# Altium schematic sheet Power.SchDoc
size A4; DocumentNumber: 2; SheetNumber: 2; SheetTotal: 4
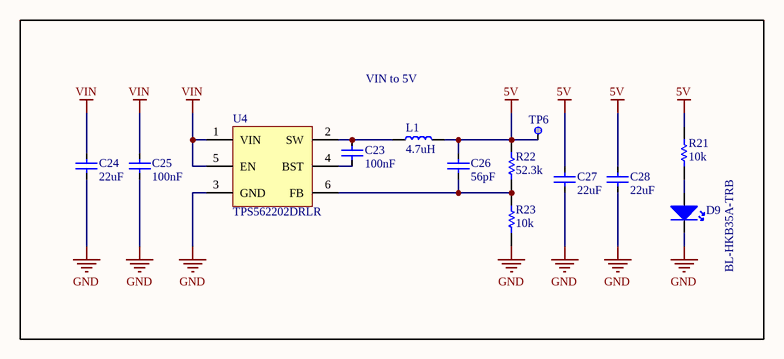
[diagram p0: Power.SchDoc]

## Parts
?  (no value)  (graphical)
C23  100nF  [CAP-0603]
C24  22uF  [CAP-1210]
C25  100nF  [CAP-0603]
C26  56pF  [CAP-0603]
C27  22uF  [CAP-1210]
C28  22uF  [CAP-1210]
D9  BL-HKB35A-TRB  [LED-0805]
L1  4.7uH  [IND_EATON_DR125-4R7-R]
R21  10k  [RES-0603]
R22  52.3k  [RES-0603]
R23  10k  [RES-0603]
TP6  Test Point  [0.8mm Test Point]  (value not drawn)  (no BOM)
U4  TPS562202DRLR  [SOT-563]

## Blocks framed on the sheet
VIN to 5V: C23-C28 D9 L1 R21-R23 TP6 U4

## Nets
5V: C26.2 C27.2 C28.2 L1.2 R21.2 R22.2 TP6.1
GND: C24.1 C25.1 C27.1 C28.1 D9.2(K) R23.1 U4.3(GND)
VIN: C24.2 C25.2 U4.1(VIN) U4.5(EN)
NetC23_1: C23.1 U4.4(BST)
NetC23_2: C23.2 L1.1 U4.2(SW)
NetC26_1: C26.1 R22.1 R23.2 U4.6(FB)
NetD9_1: D9.1(A) R21.1

## Notes on the sheet
- Project Name :
- Karadeniz Technical
- Date :
- Drawn by :
- Name :
- Sheet :
- /
- University
- Trabzon / Turkey

## Library data of the parts
? = Title Block: Standart Title Block
C23 C25 = CGA3E2X7R1H104K080AA: Manufacturer: TDK; Temperature Coefficient: X7R; Voltage: 50V; Library Reference: Capacitor; Tolerance: %10; Man Code: CGA3E2X7R1H104K080AA; Value: 100nF; Footprint: 0603; Component Type: Ceramic Capacitor
C24 C27 C28 = CL32B226KAJNNNE: Manufacturer: Samsung Electro-Mechanics; Temperature Coefficient: X7R; Voltage: 25V; Library Reference: Capacitor; Tolerance: %10; Man Code: CL32B226KAJNNNE; Value: 22uF; Footprint: 1210; Component Type: Ceramic Capacitor
C26 = GCM1885C2A560FA16D: Manufacturer: Murata; Library Reference: Capacitor; Tolerance: %1; Temperature Coefficient: C0G; Voltage: 100V; Man Code: GCM1885C2A560FA16D; Value: 56pF; Footprint: 0603; Component Type: Ceramic Capacitor
D9 = BL-HKB35A-TRB: Manufacturer: BRIGHT LED; Colour: Yellow; Vf: 2.2V; Library Reference: Miscellaneous; Luminous Intensity: 94mcd; If: 20mA; Lens Transparency: Water Clear; Man Code: BL-HKB35A-TRB; Footprint: 0805; Component Type: Led
L1 = DR125-4R7-R: Manufacturer: Eaton; Max Dc Resistance: 10.5mOhm; Tolerance: %20; Max DC Current: 7.18A; Library Reference: Inductor; Man Code: DR125-4R7-R; Value: 4.7uH; Footprint: Surface Mount (12.5mm* 12.5mm); Component Type: Fixed Inductor
R21 R23 = CRCW060310K0FKEA: Manufacturer: Vishay; Tolerance: %1; Power: 0.1W; Library Reference: Resistor; Man Code: CRCW060310K0FKEA; Value: 10k; Footprint: 0603; Component Type: Chip Resistor
R22 = ERJ-3EKF5232V: Manufacturer: Panasonic; Tolerance: %1; Power: 0.1W; Library Reference: Resistor; Man Code: ERJ-3EKF5232V; Value: 52.3k; Footprint: 0603; Component Type: Chip Resistor
TP6 = Test Point: Library Reference: Miscellaneous; Component Type: Test Point
U4 = TPS562202DRLR: Manufacturer: Texas Instruments; Library Reference: Integrated_Circuit; Man Code: TPS562202DRLR; Component Type: Switcher